# EAGLE design zxld381-boost-driver-24mm-mk-1 (EAGLE 6.4)
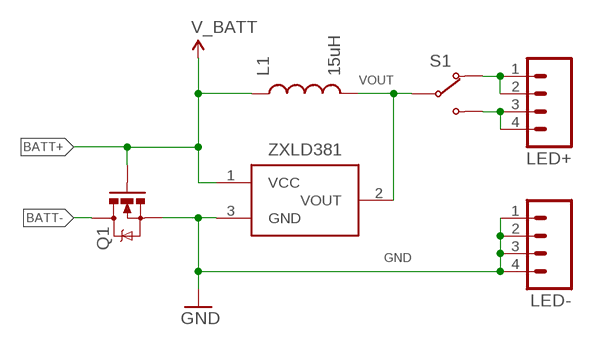
[diagram p0: schematic, sheet 1]

## Parts
L1  15uH  INDUCTOR0805  [0805]
LED+  M04PTH  [1X04-PTH-VERT]
LED-  M04PTH  [1X04-PTH-VERT]
Q1  MOSFET-NCHANNELIRLML2502  [SOT23]
S1  SWITCH-SPDTPTH-RA-2MM  [SPDT-RA-2MM]
ZXLD381  ZXLD381  [SOT23-3]

## Nets
BATT+: L1.1 Q1.1(G) ZXLD381.1(VCC) ; supply symbol labelled V_BATT
BATT-: Q1.3(D)
GND: LED-.1 LED-.2 LED-.3 LED-.4 Q1.2(S) ZXLD381.3(GND)
N$1: LED+.1 LED+.2 S1.1(NC)
N$2: LED+.3 LED+.4 S1.3(NO)
VOUT: L1.2 S1.2(COM) ZXLD381.2(VOUT)

## Library data of the parts
L1 = A_butts:INDUCTOR: Inductors Basic Inductor/Choke - 0603 and 1206. Footprints are not proven and vary greatly between part numbers. SRN6045- 33uH, 20% 1.4A SDR0403-560KL - 56uH, 10%, 500mA RMS/740mA peak
LED+ LED- = A_butts:M04: Header 4 Standard 4-pin 0.1" header. Use with straight break away headers (SKU : PRT-00116), right angle break away headers (PRT-00553), swiss pins (PRT-00743), machine pins (PRT-00117), and female headers (PRT-00115). Molex polarized connector foot print use with SKU : PRT-08231 with associated crimp pins and housings. 1MM SMD Version SKU: PRT-10208
Q1 = A_butts:MOSFET-NCHANNEL: Common NMOSFET Parts MFG P/N Store ID Prod ID FDD8780 TRANS-09984 SI7820DN TRANS-11055 FDS6630A IC-08089 2N7002PW TRANS-11151 FQP30N06L COM-10213 TRANS-10060 BSS123LT1G TRANS-08345 BSS138 TRANS-00830 BS170 2N7000
S1 = A_butts:SWITCH-SPDT
ZXLD381 = A_butts:ZXLD381

## Board
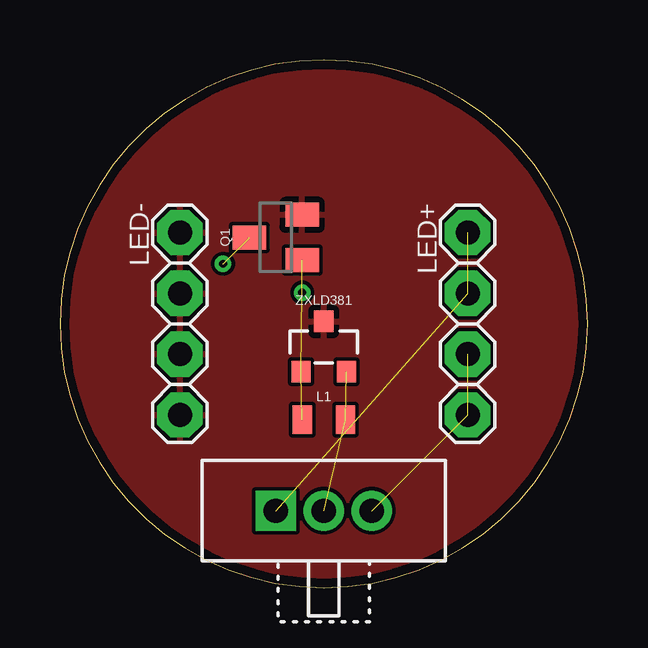
[diagram p1: board, top side]
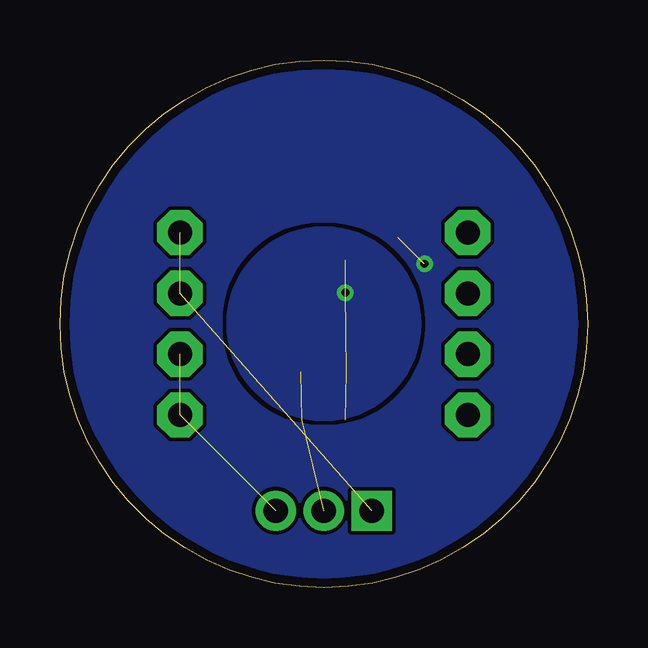
[diagram p2: board, bottom side, seen from below]

Size 22 x 22 mm. Coordinates in mm from the lower left corner, seen from the top.
Outline: 0,11 arc90 11,0 arc90 22,11 arc90 11,22 arc90 0,11
Copper layers (1*16): Top 0.0356mm / dielectric 1.5011mm / Bottom 0.0356mm
Design rules "LaenPCBOrder2": minimum track width 6mil, minimum drill 13mil, track to track 6mil, track to pad 6mil, pad to pad 6mil, via to via 6mil, smd to smd 6mil, copper to edge 15mil, drill to drill 6mil, minimum pad ring 7mil, minimum via ring 7mil, stop-mask expansion 3mil, vias tented up to drill 20mil, thermal gap 10mil

### Footprints (pad centres in the part's own frame; a part is rotated, then mirrored left to right if it is on the bottom)
0805 = smd 0.8 x 1.2: 1 -0.9,0; 2 0.9,0
1X04-PTH-VERT = drill 1 pad 1.88 octagon: 1 0,0; 2 2.54,0; 3 5.08,0; 4 7.62,0
SOT23 = smd 1 x 1.4: 1 -0.95,-1.1; 2 0.95,-1.1; 3 0,1.1
SPDT-RA-2MM = drill 1.016 pad 1.676 square: 1 -2,0 | drill 1.016 pad 1.676: 2 0,0; 3 2,0
SOT23-3 = smd 0.8 x 0.9: 1 -0.95,-1; 2 0.95,-1; 3 0,1.1

### Placement (x,y rotation side)
L1  11,7 0 top
LED+  17,14.81 270 top
LED-  5,14.81 270 top
Q1  9,14.6 90 top
S1  11,3.2 0 top
ZXLD381  11,10 0 top

### Tracks (layer width: path | path; a pad name or v marks a point on that pad's centre or on a via)
BATT+  (via drill 0.33)  (3 unrouted)
  other vias: 10.1,12.3
  pour Bottom: 11,7 arc-90 7,11 arc-90 11,15 arc-90 15,11 arc-90
BATT-  (via drill 0.33)  (1 unrouted)
  other vias: 6.8,13.5
  pour Bottom (rank 6): 11,0 arc-90 0,11 arc-90 11,22 arc-90 22,11 arc-90
GND
  pour Top: 11,0 arc-90 0,11 arc-90 11,22 arc-90 22,11 arc-90
N$1  (2 unrouted)
N$2  (2 unrouted)
VOUT  (2 unrouted)